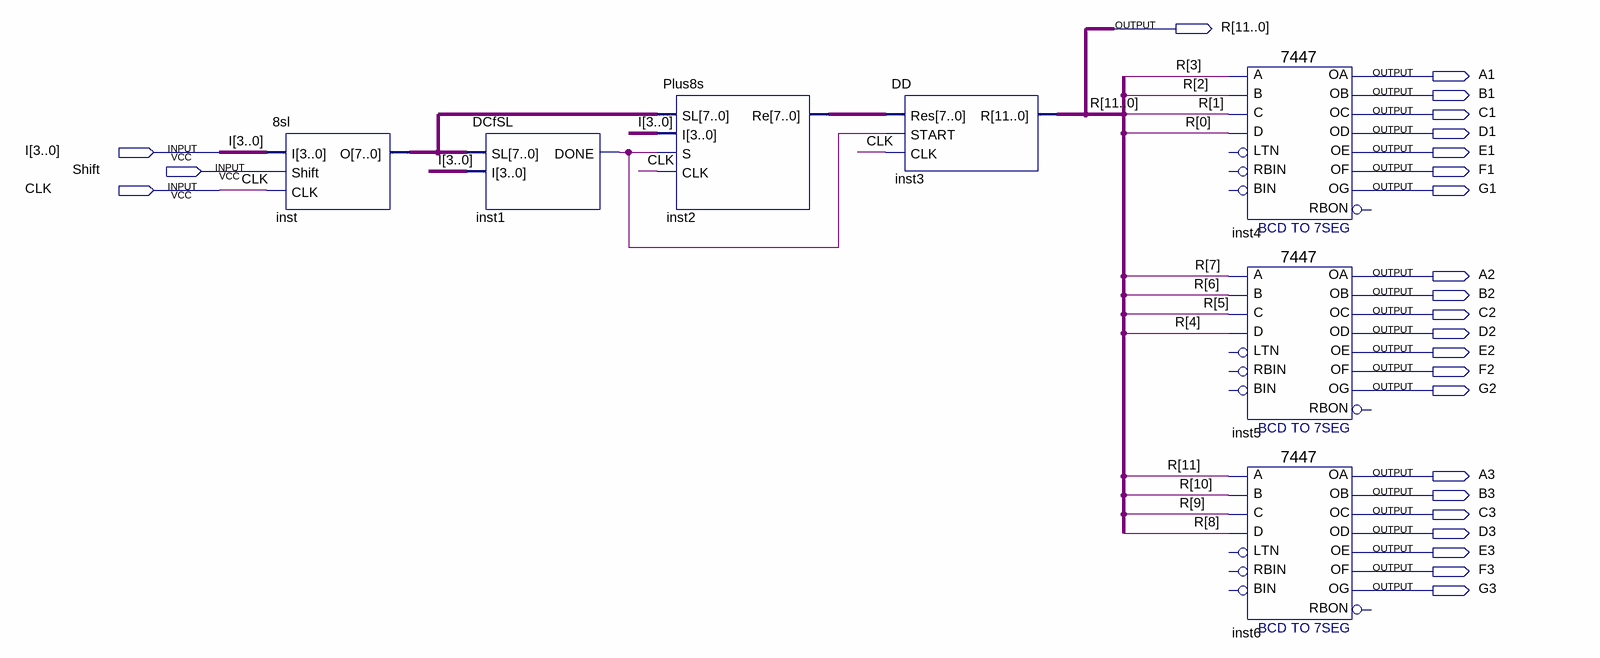
[diagram p0: schematic sheet]
// Quartus schematic Mw9.bdf as structural Verilog: 7 symbols, 25 pins
module Mw9 (
  input  [3:0] I,
  input  Shift,
  input  CLK,
  output [11:0] R,
  output A1,
  output B1,
  output C1,
  output D1,
  output E1,
  output F1,
  output G1,
  output A2,
  output B2,
  output C2,
  output D2,
  output E2,
  output F2,
  output G2,
  output A3,
  output B3,
  output C3,
  output D3,
  output E3,
  output F3,
  output G3
);

  wire inst1_done;
  wire [7:0] inst2_re, inst_o;

  \8sl  inst (.I(I), .Shift(Shift), .CLK(CLK), .O(inst_o));
  DCfSL inst1 (.SL(inst_o), .I(I), .DONE(inst1_done));
  Plus8s inst2 (.SL(inst_o), .I(I), .S(inst1_done), .CLK(CLK), .Re(inst2_re));
  DD inst3 (.Res(inst2_re), .START(inst1_done), .CLK(CLK), .R(R));
  \7447  inst4 (
    .B(R[2]), .C(R[1]), .D(R[0]), .A(R[3]), .OB(B1), .OC(C1), .OE(E1), .OD(D1), .OF(F1), .OG(G1), .OA(A1));  // open: LTN, RBIN, BIN, RBON
  \7447  inst5 (
    .B(R[6]), .C(R[5]), .D(R[4]), .A(R[7]), .OB(B2), .OC(C2), .OE(E2), .OD(D2), .OF(F2), .OG(G2), .OA(A2));  // open: LTN, RBIN, BIN, RBON
  \7447  inst6 (
    .B(R[10]), .C(R[9]), .D(R[8]), .A(R[11]), .OB(B3), .OC(C3), .OE(E3), .OD(D3), .OF(F3), .OG(G3), .OA(A3));  // open: LTN, RBIN, BIN, RBON
endmodule
